# EAGLE design Avery_Bellis_board (EAGLE 8.1.0)
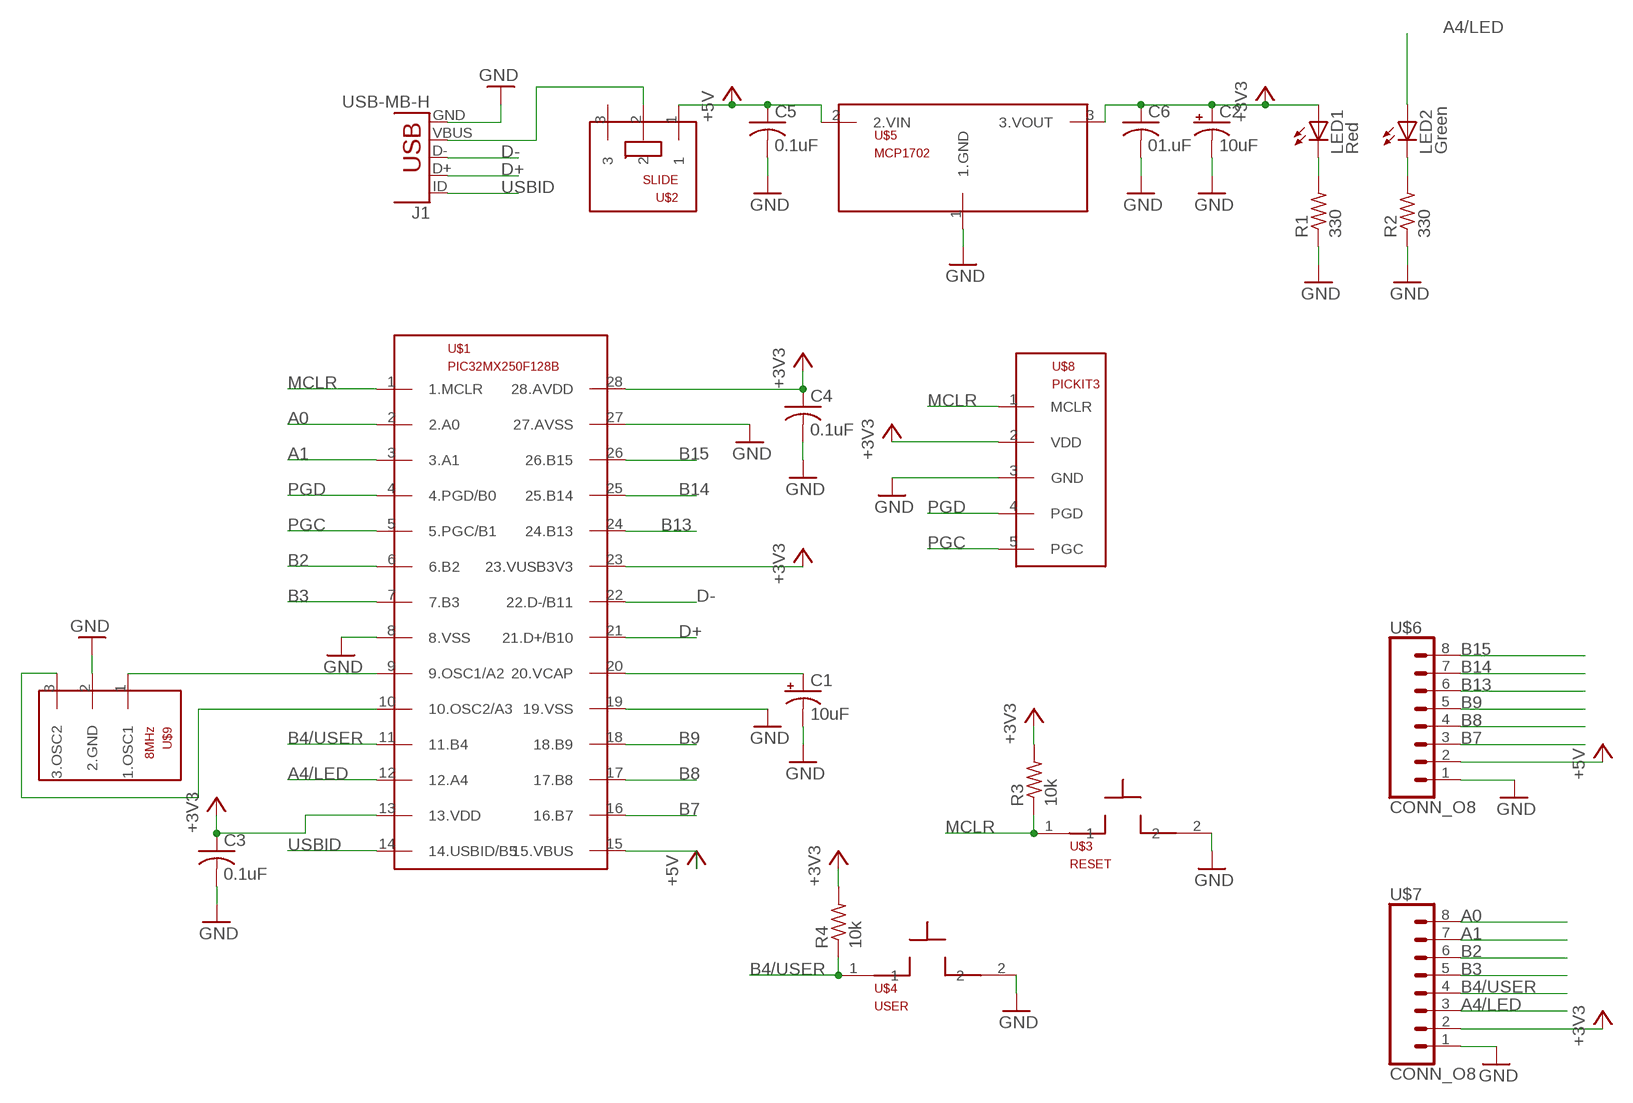
[diagram p0: schematic, sheet 1]

## Parts
C1  10uF  CPOL-USB45181B  [B45181B]
C2  10uF  CPOL-USB45181B  [B45181B]
C3  0.1uF  C-US025-025X050  [C025-025X050]
C4  0.1uF  C-US025-025X050  [C025-025X050]
C5  0.1uF  C-US025-025X050  [C025-025X050]
C6  01.uF  C-US025-025X050  [C025-025X050]
J1  USB-MB-H  [USB-MB-H]
LED1  Red  LED3MM  [LED3MM]
LED2  Green  LED3MM  [LED3MM]
R1  330  R-US_0207/10  [0207/10]
R2  330  R-US_0207/10  [0207/10]
R3  10k  R-US_0207/10  [0207/10]
R4  10k  R-US_0207/10  [0207/10]
U$1  PIC32MX250F128B  [DIL28-3]
U$2  SLIDE  [SLIDE]
U$3  RESET  PUSHB  [PUSHB]
U$4  USER  PUSHB  [PUSHB]
U$5  MCP1702  [TO92]
U$6  CONN_O8  [1X08]
U$7  CONN_O8  [1X08]
U$8  PICKIT3  [1X05]
U$9  8MHz  OSC  [OSC]

## Nets
+3V3: C2.+ C3.1 C4.1 C6.1 LED1.A R3.2 R4.2 U$1.13(13.VDD) U$1.23(23.VUSB3V3) U$1.28(28.AVDD) U$5.3(3.VOUT) U$7.2 U$8.2(VDD)
+5V: C5.1 U$1.15(15.VBUS) U$2.1 U$5.2(2.VIN) U$6.2
A0: U$1.2(2.A0) U$7.8
A1: U$1.3(3.A1) U$7.7
A4/LED: LED2.A U$1.12(12.A4) U$7.3
B2: U$1.6(6.B2) U$7.6
B3: U$1.7(7.B3) U$7.5
B4/USER: R4.1 U$1.11(11.B4) U$4.1 U$7.4
B7: U$1.16(16.B7) U$6.3
B8: U$1.17(17.B8) U$6.4
B9: U$1.18(18.B9) U$6.5
B13: U$1.24(24.B13) U$6.6
B14: U$1.25(25.B14) U$6.7
B15: U$1.26(26.B15) U$6.8
D+: J1.D+ U$1.21(21.D+/B10)
D-: J1.D- U$1.22(22.D-/B11)
GND: C1.- C2.- C3.2 C4.2 C5.2 C6.2 J1.GND R1.1 R2.1 U$1.8(8.VSS) U$1.19(19.VSS) U$1.27(27.AVSS) U$3.2 U$4.2 U$5.1(1.GND) U$6.1 U$7.1 U$8.3(GND) U$9.2(2.GND)
MCLR: R3.1 U$1.1(1.MCLR) U$3.1 U$8.1(MCLR)
N$1: J1.VBUS U$2.2
N$2: LED2.K(C) R2.2
N$3: LED1.K(C) R1.2
N$4: U$1.9(9.OSC1/A2) U$9.1(1.OSC1)
N$5: U$1.10(10.OSC2/A3) U$9.3(3.OSC2)
N$7: C1.+ U$1.20(20.VCAP)
PGC: U$1.5(5.PGC/B1) U$8.5(PGC)
PGD: U$1.4(4.PGD/B0) U$8.4(PGD)
USBID: J1.ID U$1.14(14.USBID/B5)
Unconnected: U$2.3

## Library data of the parts
C1 C2 = Avery_Bellis_library:CPOL-US: POLARIZED CAPACITOR, American symbol
C3-C6 = Avery_Bellis_library:C-US: CAPACITOR, American symbol
J1 = Avery_Bellis_library:USB: USB Connectors USB-B-PTH is fully proven SKU : PRT-00139/CONN-08278 USB-miniB is fully proven SKU : PRT-00587 USB-A-PCB is untested. USB-A-H is throughly reviewed, but untested. Spark Fun Electronics SKU : PRT-00437 USB-B-SMT is throughly reviewed, but untested. Needs silkscreen touching up. USB-A-S has not been used/tested USB-MB-H has not been used/tested USB-MICROB has been used. CONN-09505
LED1 LED2 = led:LED: LED OSRAM: - CHIPLED LG R971, LG N971, LY N971, LG Q971, LY Q971, LO R971, LY R971 LH N974, LH R974 LS Q976, LO Q976, LY Q976 LO Q996 - Hyper CHIPLED LW Q18S LB Q993, LB Q99A, LB R99A - SideLED LS A670, LO A670, LY A670, LG A670, LP A670 LB A673, LV A673, LT A673, LW A673 LH A674 LY A675 LS A676, LA A676, LO A676, LY A676, LW A676 LS A679, LY A679, LG A679 - Hyper Micro SIDELED® LS Y876, LA Y876, LO Y876, LY Y876 LT Y87S - SmartLED LW L88C, LW L88S LB L89C, LB L89S, LG L890 LS L89K, LO L89K, LY L89K LS L896, LA L896, LO L896, LY L896 - TOPLED LS T670, LO T670, LY T670, LG T670, LP T670 LSG T670, LSP T670, LSY T670, LOP T670, LYG T670 LG T671, LOG T671, LSG T671 LB T673, LV T673, LT T673, LW T673 LH T674 LS T676, LA T676, LO T676, LY T676, LB T676, LH T676, LSB T676, LW T676 LB T67C, LV T67C, LT T67C, LS T67K, LO T67K, LY T67K, LW E67C LS E67B, LA E67B, LO E67B, LY E67B, LB E67C, LV E67C, LT E67C LW T67C LS T679, LY T679, LG T679 LS T770, LO T770, LY T770, LG T770, LP T770 LB T773, LV T773, LT T773, LW T773 LH T774 LS E675, LA E675, LY E675, LS T675 LS T776, LA T776, LO T776, LY T776, LB T776 LHGB T686 LT T68C, LB T68C - Hyper Mini TOPLED® LB M676 - Mini TOPLED Santana® LG M470 LS M47K, LO M47K, LY M47K Source: http://www.osram.convergy.de LUXEON: - LUMILED® LXK2-PW12-R00, LXK2-PW12-S00, LXK2-PW14-U00, LXK2-PW14-V00 LXK2-PM12-R00, LXK2-PM12-S00, LXK2-PM14-U00 LXK2-PE12-Q00, LXK2-PE12-R00, LXK2-PE12-S00, LXK2-PE14-T00, LXK2-PE14-U00 LXK2-PB12-K00, LXK2-PB12-L00, LXK2-PB12-M00, LXK2-PB14-N00, LXK2-PB14-P00, LXK2-PB14-Q00 LXK2-PR12-L00, LXK2-PR12-M00, LXK2-PR14-Q00, LXK2-PR14-R00 LXK2-PD12-Q00, LXK2-PD12-R00, LXK2-PD12-S00 LXK2-PH12-R00, LXK2-PH12-S00 LXK2-PL12-P00, LXK2-PL12-Q00, LXK2-PL12-R00 Source: www.luxeon.com KINGBRIGHT: KA-3528ASYC Source: www.kingbright.com
R1-R4 = Avery_Bellis_library:R-US_: RESISTOR, American symbol
U$1 = Avery_Bellis_library:PIC32MX250F128B
U$2 = Avery_Bellis_library:SLIDE
U$3 U$4 = Avery_Bellis_library:PUSHB
U$5 = Avery_Bellis_library:MCP1702
U$6 U$7 = Avery_Bellis_library:CONN_O8
U$8 = Avery_Bellis_library:PICKIT3
U$9 = Avery_Bellis_library:OSC

## Board
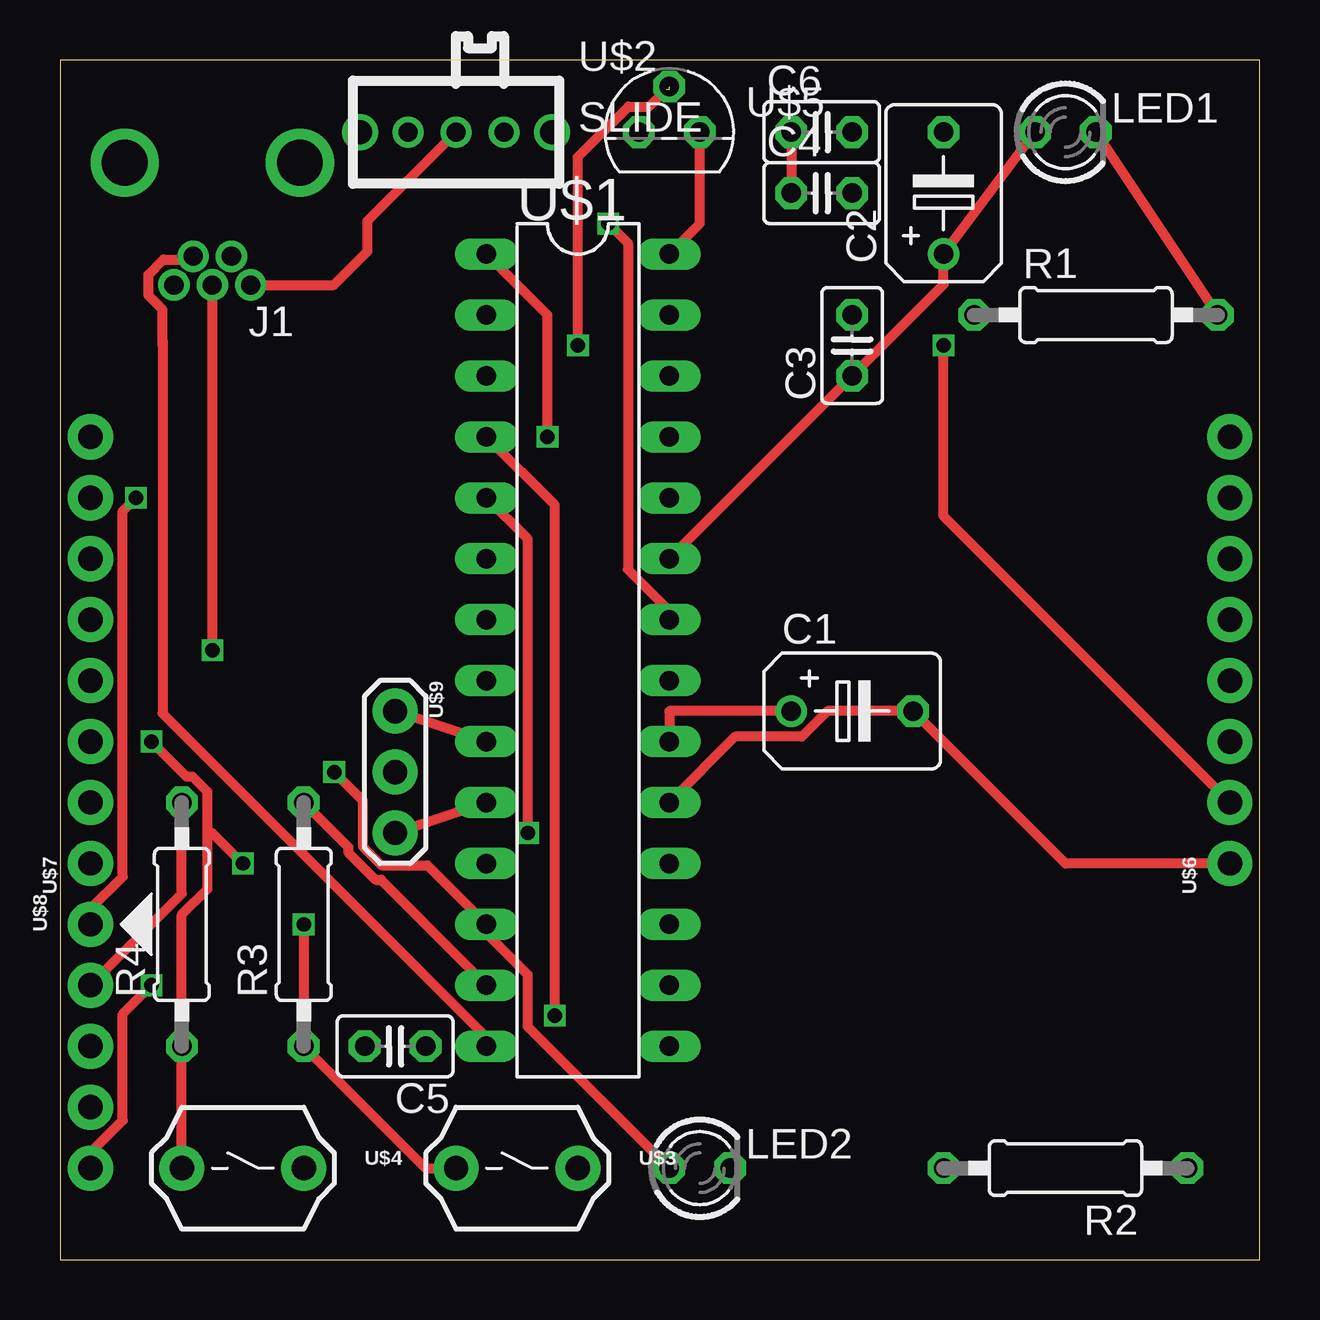
[diagram p1: board, top side]
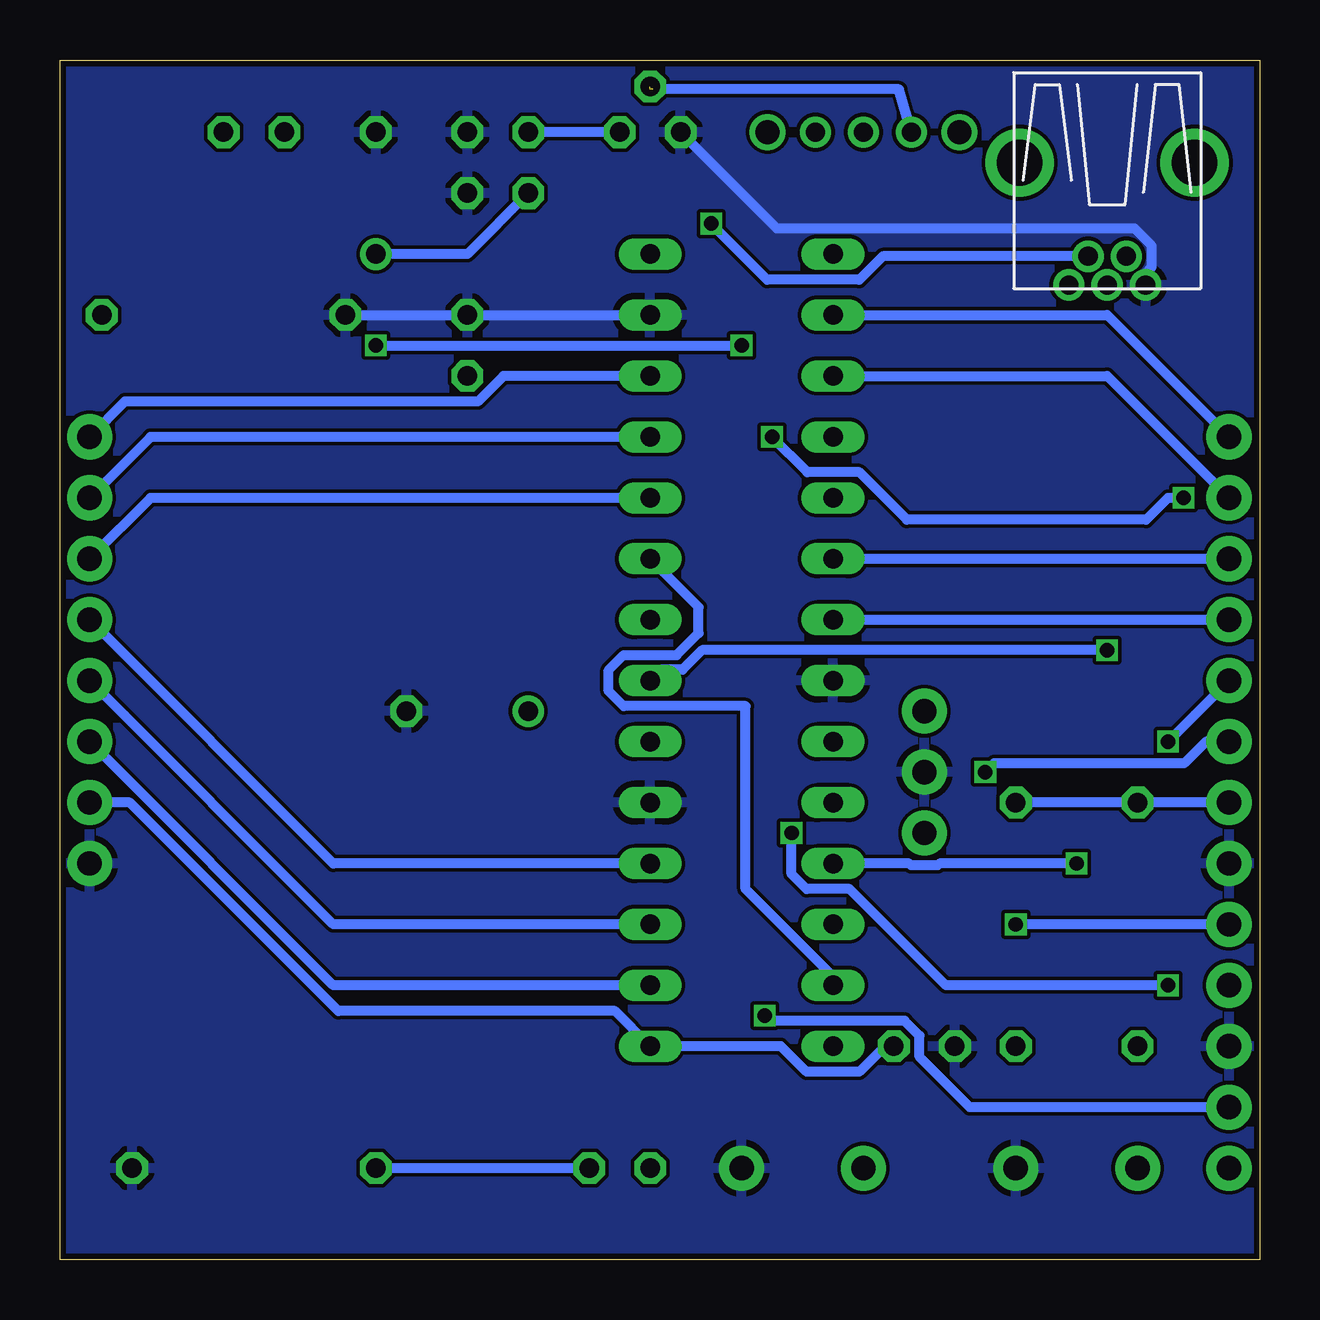
[diagram p2: board, bottom side, seen from below]

Size 50 x 50 mm. Coordinates in mm from the lower left corner, seen from the top.
Outline: 0,0 50,0 50,50 0,50 0,0
Copper layers (1*16): Top 0.035mm / dielectric 1.5mm / Bottom 0.035mm
Design rules "SeedGerberGenerator2": minimum track width 6mil, minimum drill 12mil, track to track 6mil, track to pad 6mil, pad to pad 6mil, via to via 6mil, smd to smd 0mil, copper to edge 10mil, drill to drill 10mil, minimum pad ring 10mil, minimum via ring 6mil, stop-mask expansion 2mil, vias tented up to drill 100mil, thermal gap 10mil

### Footprints (pad centres in the part's own frame; a part is rotated, then mirrored left to right if it is on the bottom)
B45181B = drill 0.813: + -2.54,0 | drill 0.813 octagon: - 2.54,0
C025-025X050 = drill 0.813 octagon: 1 -1.27,0; 2 1.27,0
USB-MB-H = drill 0.8: D+ 5.1,0; D- 3.9,0.8; GND 5.1,-1.6; ID 3.9,-0.8; VBUS 5.1,1.6 | drill 1.9: P$6 0,-3.65; P$7 0,3.65
LED3MM = drill 0.813 octagon: A -1.27,0; K 1.27,0
0207/10 = drill 0.813 octagon: 1 -5.08,0; 2 5.08,0
DIL28-3 = drill 0.813 long: 1 -16.51,-3.81; 2 -13.97,-3.81; 3 -11.43,-3.81; 4 -8.89,-3.81; 5 -6.35,-3.81; 6 -3.81,-3.81; 7 -1.27,-3.81; 8 1.27,-3.81; 9 3.81,-3.81; 10 6.35,-3.81; 11 8.89,-3.81; 12 11.43,-3.81; 13 13.97,-3.81; 14 16.51,-3.81; 15 16.51,3.81; 16 13.97,3.81; 17 11.43,3.81; 18 8.89,3.81; 19 6.35,3.81; 20 3.81,3.81; 21 1.27,3.81; 22 -1.27,3.81; 23 -3.81,3.81; 24 -6.35,3.81; 25 -8.89,3.81; 26 -11.43,3.81; 27 -13.97,3.81; 28 -16.51,3.81
SLIDE = drill 0.8: 1 -2,0; 2 0,0; 3 2,0 | drill 1: P$1 -4,0; P$2 4,0
PUSHB = drill 1.016 pad 1.88: 1 -2.54,0; 2 2.54,0
TO92 = drill 0.813 octagon: 1 -1.27,0; 2 0,1.905; 3 1.27,0
1X08 = drill 1.016 pad 1.88: 1 0,0; 2 2.54,0; 3 5.08,0; 4 7.62,0; 5 10.16,0; 6 12.7,0; 7 15.24,0; 8 17.78,0
1X05 = drill 1.016 pad 1.88: 1 0,0; 2 2.54,0; 3 5.08,0; 4 7.62,0; 5 10.16,0
OSC = drill 1.016 pad 1.88: 1 -2.54,0; 2 0,0; 3 2.54,0

### Placement (x,y rotation side)
C1  33.02,22.86 0 top
C2  36.83,44.45 90 top
C3  33.02,38.1 90 top
C4  31.75,44.45 0 top
C5  13.97,8.89 180 top
C6  31.75,46.99 0 top
J1  6.35,45.72 270 top
LED1  41.91,46.99 0 top
LED2  26.67,3.81 0 top
R1  43.18,39.37 0 top
R2  41.91,3.81 180 top
R3  10.16,13.97 90 top
R4  5.08,13.97 90 top
U$1  21.59,25.4 270 top
U$2  16.51,46.99 0 top
U$3  19.05,3.81 0 top
U$4  7.62,3.81 0 top
U$5  25.4,46.99 0 top
U$6  48.77,16.51 90 top
U$7  1.27,16.51 90 top
U$8  1.27,13.97 270 top
U$9  13.97,20.32 270 top

### Tracks (layer width: path | path; a pad name or v marks a point on that pad's centre or on a via)
+3V3
  Top 0.406: LED1.A C2.+ 36.83,40.64 C3.1 U$1.23 | U$8.2 5.08,15.24 R4.2 | U$1.28 26.67,43.18 U$5.3 | C6.1 C4.1 | R3.2 12.01,17.2 12.01,16.97 13.16,15.82 13.39,15.82 U$1.13
  Bottom 0.406: U$7.2 R4.2 R3.2 | U$5.3 C6.1 | C4.1 33.02,41.91 C2.+ | U$1.13 17.78,11.8 21.42,15.44 21.42,23.06 26.5,23.06 27.13,23.69 27.13,24.57 26.5,25.2 24.3,25.2 23.38,26.11 23.38,27.19 U$1.23
+5V  (via drill 0.6)  (2 unrouted)
  Top 0.406: U$6.2 36.83,30.99 v36.83,38.1 | 25.29,48.78 24.56,48.06 23.69,48.06 21.59,45.96 v21.59,38.1
  Bottom 0.406: C5.1 15.61,8.89 16.68,7.82 18.88,7.82 19.95,8.89 U$1.15 26.87,10.36 38.4,10.36 47.09,19.05 U$6.2 | U$2.1 15.03,48.78 25.4,48.78 | v36.83,38.1 v21.59,38.1
A0
  Bottom 0.406: U$1.2 6.35,39.37 U$7.8
A1
  Bottom 0.406: U$1.3 6.35,36.83 U$7.7
A4/LED  (via drill 0.6)
  Top 0.406: LED2.A 19.51,9.7 19.51,11.87 17.78,13.6 U$1.12 15.32,16.43 13.41,16.43 12.62,17.22 12.62,19.13 v11.43,20.32
  Bottom 0.406: U$7.3 2.23,21.59 3.14,20.68 11.07,20.68 v11.43,20.32
B2
  Bottom 0.406: U$1.6 U$7.6
B3
  Bottom 0.406: U$1.7 U$7.5
B4/USER  (via drill 0.6)
  Top 0.406: U$4.1 R4.1 5.08,14.38 6.15,15.45 6.15,17.78 | 6.15,17.78 6.15,19.49 5.52,20.12 5.28,20.12 v3.81,21.59 | 6.15,17.78 6.35,17.78 v7.62,16.51
  Bottom 0.406: v3.81,21.59 U$7.4 | v7.62,16.51 13.34,16.51 13.41,16.43 14.53,16.43 14.6,16.51 U$1.11
B7
  Bottom 0.406: U$1.16 38.61,11.43 U$6.3
B8
  Bottom 0.406: U$1.17 38.61,13.97 U$6.4
B9
  Bottom 0.406: U$1.18 38.61,16.51 U$6.5
B13
  Bottom 0.406: U$1.24 46.23,31.75 U$6.6
B14
  Bottom 0.406: U$1.25 46.23,34.29 U$6.7
B15
  Bottom 0.406: U$1.26 31.51,36.83 32.58,35.76 47.3,35.76 U$6.8
D+  (via drill 0.6)
  Top 0.406: J1.D+ v6.35,25.4
  Bottom 0.406: v6.35,25.4 23.23,25.4 24.05,24.59 24.94,24.59 U$1.21
D-  (via drill 0.6)
  Top 0.406: v22.86,43.18 23.67,42.37 23.67,28.77 25.4,27.04 U$1.22
  Bottom 0.406: v22.86,43.18 22.66,42.98 | 22.86,43.09 v22.86,43.18 | J1.D- 15.7,41.82 16.68,40.84 20.52,40.84 v22.86,43.18
GND
  Top 0.406: U$1.19 28.14,21.79 30.92,21.79 31.99,22.86 C1.- 41.91,16.51 U$6.1
  Bottom 0.406: U$1.27 C3.2 R1.1 | 23.77,46.63 U$5.1 20.12,42.98 5.21,42.98 4.49,42.26 4.49,41.38 4.75,41.12 J1.GND
  pour Bottom: 0,50.8 0,-1.27 50.8,-1.27 50.8,0 50.8,50.8
MCLR  (via drill 0.6)
  Top 0.406: v10.16,13.97 R3.1 15.24,3.81 U$3.1 | v3.16,31.75 2.62,31.2 2.62,15.95 1.27,14.61 U$8.1 | v20.32,34.29 20.32,39.37 U$1.1
  Bottom 0.406: U$8.1 v10.16,13.97 | v20.32,34.29 18.85,32.82 16.68,32.82 14.7,30.84 4.73,30.84 3.82,31.75 v3.16,31.75
N$1
  Top 0.406: U$2.2 12.82,43.3 12.82,42.03 11.41,40.62 J1.VBUS
N$2
  Bottom 0.406: LED2.K R2.2
N$3
  Top 0.406: LED1.K R1.2
N$4
  Top 0.406: U$9.1 U$1.9
N$5
  Top 0.406: U$9.3 U$1.10
N$7
  Top 0.406: C1.+ 25.4,22.86 U$1.20
PGC  (via drill 0.6)
  Top 0.406: U$8.5 1.27,4.45 2.62,5.79 2.62,10.24 v3.81,11.43 | v19.51,17.78 19.51,30.02 U$1.5
  Bottom 0.406: v19.51,17.78 19.51,16.07 18.88,15.44 17.08,15.44 13.07,11.43 v3.81,11.43
PGD  (via drill 0.6)
  Top 0.406: v20.62,10.17 20.62,31.45 U$1.4
  Bottom 0.406: U$8.4 12.07,6.35 14.17,8.45 14.17,9.33 14.8,9.96 20.42,9.96 v20.62,10.17
USBID
  Top 0.406: U$1.14 17.78,9.26 4.28,22.76 4.28,38.1 | 4.28,38.32 4.28,38.1 | 4.28,38.1 4.28,39.59 3.69,40.18 3.69,41.06 4.31,41.68 5.41,41.68 J1.ID